# EAGLE design riffle328-REVB (EAGLE 6.5.0)
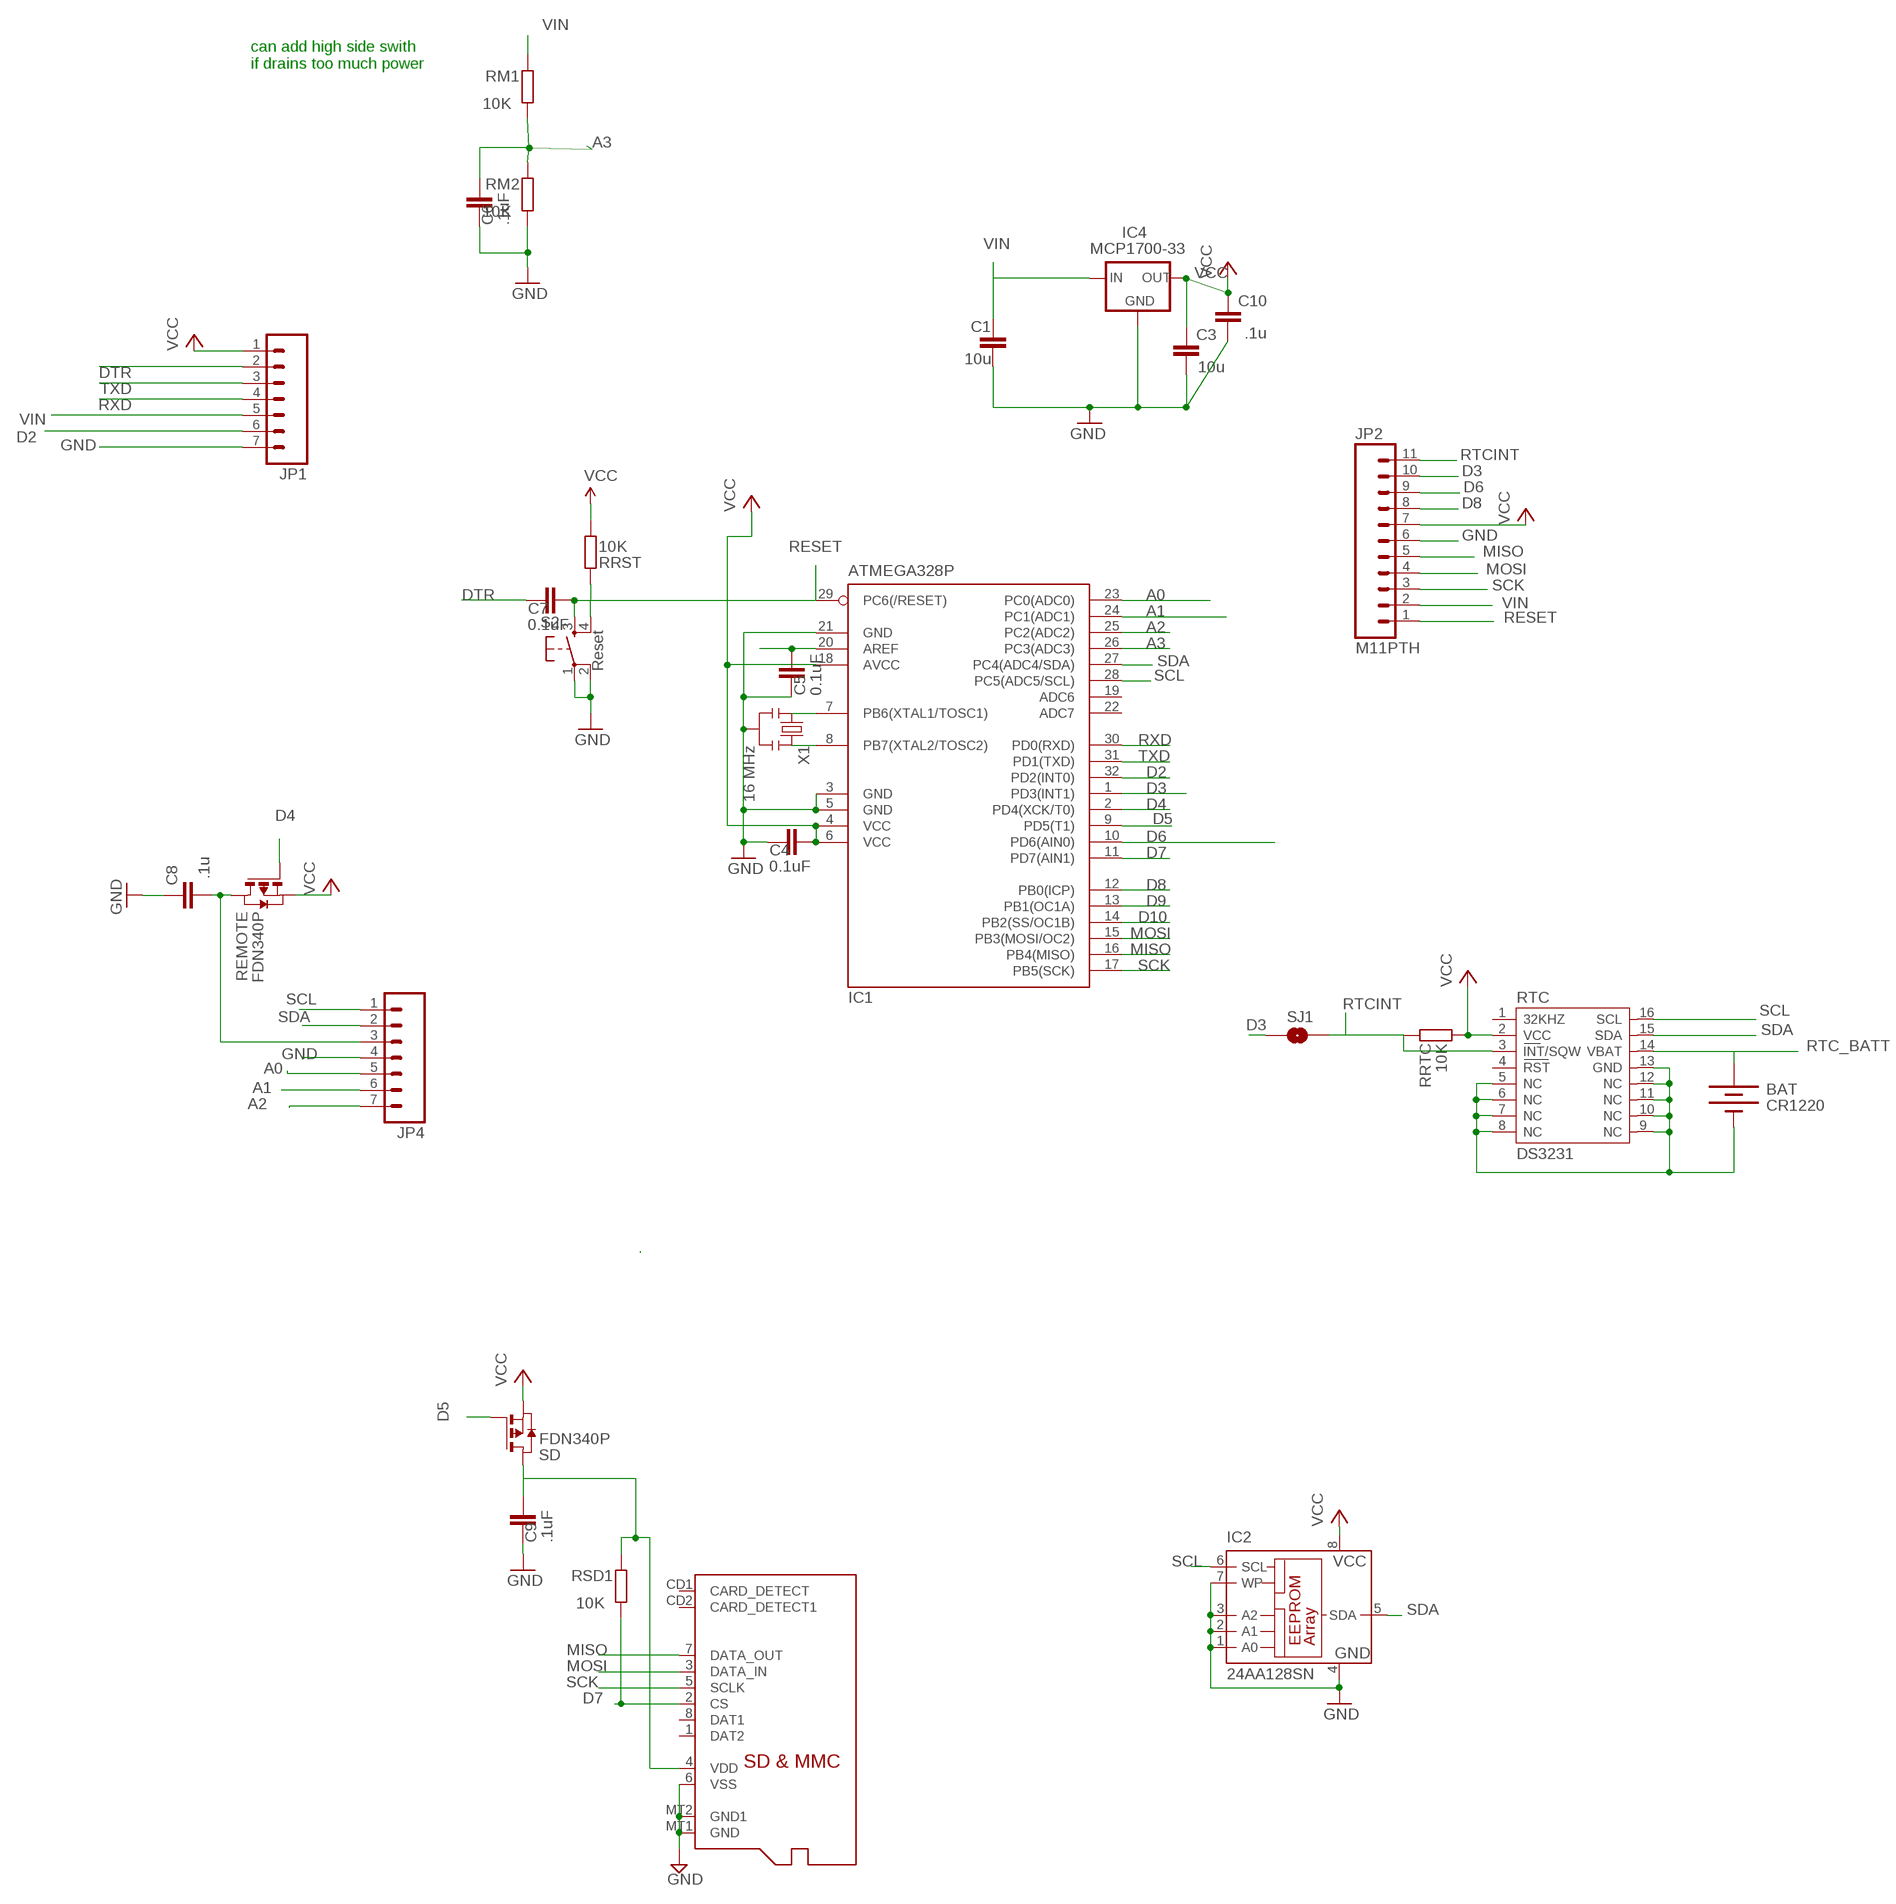
[diagram p0: schematic, sheet 1]

## Parts
BAT  CR1220  BATTERYBATTERY_12MM_SMT  [BATTCON_12MM_SMT]
C1  10u  C-EUC0805  [C0805]
C3  10u  C-EUC0805  [C0805]
C4  0.1uF  C-EUC0805  [C0805@1]
C5  0.1uF  C-EUC0805  [C0805@1]
C6  .1uF  C-EUC0805  [C0805@1]
C7  0.1uF  C-EUC0805  [C0805@1]
C8  .1u  C-EUC0805  [C0805]
C9  .1uF  C-EUC0805  [C0805@1]
C10  .1u  C-EUC0805  [C0805]
IC1  ATMEGA328P  MEGA8-AI  [TQFP32-08]
IC2  24AA128SN  [SO-08]
IC4  MCP1700-33  MCP1700SOT233  [SOT23]
JP1  M07  [1X07]
JP2  M11PTH  [1X11]
JP4  M07  [1X07]
MICROSD  MICROSD  [MICROSD]
REMOTE  FDN340P  PMOSSOT23  [SOT-23]
RM1  10K  R-EU_R0805  [R0805]
RM2  10K  R-EU_R0805  [R0805]
RRST  10K  R-EU_R0805  [R0805]
RRTC  10K  R-EU_R0805  [R0805]
RSD1  10K  R-EU_R0805  [R0805]
RTC  DS3231  [DS3231]
S2  Reset  TAC_SWITCHSMD  [TACTILE_SWITCH_SMD]
SD  FDN340P  PMOSSOT23  [SOT-23]
SJ1  SOLDERJUMPERNO  [SJ_2S-NO]
X1  16 MHz  RESONATORSMD  [RESONATOR-SMD]

## Nets
A0: IC1.23(PC0(ADC0)) JP4.5
A1: IC1.24(PC1(ADC1)) JP4.6
A2: IC1.25(PC2(ADC2)) JP4.7
A3: C6.2 IC1.26(PC3(ADC3)) RM1.1 RM2.2
AREF: C5.2 IC1.20(AREF)
D2: IC1.32(PD2(INT0)) JP1.6
D3: IC1.1(PD3(INT1)) JP2.10 SJ1.2
D4: IC1.2(PD4(XCK/T0)) REMOTE.3(G)
D5: IC1.9(PD5(T1)) SD.3(G)
D6: IC1.10(PD6(AIN0)) JP2.9
D7: IC1.11(PD7(AIN1)) MICROSD.2(CS) RSD1.1
D8: IC1.12(PB0(ICP)) JP2.8
D9: IC1.13(PB1(OC1A))
D10: IC1.14(PB2(SS/OC1B))
DTR: C7.1 JP1.2
GND: BAT.P$1(-) C1.2 C3.2 C4.1 C5.1 C6.1 C8.1 C9.1 C10.2 IC1.3(GND) IC1.5(GND) IC1.21(GND) IC2.1(A0) IC2.2(A1) IC2.3(A2) IC2.4(GND) IC2.7(WP) IC4.1(GND) JP1.7 JP2.6 JP4.4 MICROSD.6(VSS) MICROSD.MT1(GND) MICROSD.MT2(GND1) RM2.1 RTC.5(NC) RTC.6(NC) RTC.7(NC) RTC.8(NC) RTC.9(NC) RTC.10(NC) RTC.11(NC) RTC.12(NC) RTC.13(GND) S2.1 S2.2 X1.2
MISO: IC1.16(PB4(MISO)) JP2.5 MICROSD.7(DATA_OUT)
MOSI: IC1.15(PB3(MOSI/OC2)) JP2.4 MICROSD.3(DATA_IN)
N$2: IC1.8(PB7(XTAL2/TOSC2)) X1.3
N$3: IC1.7(PB6(XTAL1/TOSC1)) X1.1
RESET: C7.2 IC1.29(PC6(/RESET)) JP2.1 RRST.2 S2.3 S2.4
RTC_BATT: BAT.P$2(+) RTC.14(VBAT)
RTCINT: JP2.11 RRTC.2 RTC.3(INT/SQW) SJ1.1
RXD: IC1.30(PD0(RXD)) JP1.4
SCK: IC1.17(PB5(SCK)) JP2.3 MICROSD.5(SCLK)
SCL: IC1.28(PC5(ADC5/SCL)) IC2.6(SCL) JP4.1 RTC.16(SCL)
SDA: IC1.27(PC4(ADC4/SDA)) IC2.5(SDA) JP4.2 RTC.15(SDA)
TXD: IC1.31(PD1(TXD)) JP1.3
VCC: C3.1 C4.2 C8.2 C10.1 IC1.4(VCC) IC1.6(VCC) IC1.18(AVCC) IC2.8(VCC) IC4.2(OUT) JP1.1 JP2.7 JP4.3 REMOTE.1(D) REMOTE.2(S) RRST.1 RRTC.1 RTC.2(VCC) SD.2(S)
VDD: C9.2 MICROSD.4(VDD) RSD1.2 SD.1(D)
VIN [power]: C1.1 IC4.3(IN) JP1.5 JP2.2 RM1.2
Unconnected: IC1.19(ADC6) IC1.22(ADC7) MICROSD.1(DAT2) MICROSD.8(DAT1) MICROSD.CD1(CARD_DETECT) MICROSD.CD2(CARD_DETECT1) RTC.1(32KHZ) RTC.4(RST)

## Notes on the sheet
- can add high side swith
  if drains too much power

## Library data of the parts
BAT = SparkFunNew:BATTERY: Battery Holders Various common sizes : AA, AAA, 20mm coin cell and 12mm coin cell.
C1 C3 C8 C10 = resistor:C-EU: CAPACITOR, European symbol
C4-C7 C9 = rcl:C-EU: CAPACITOR, European symbol
IC1 = atmel:MEGA8: MICROCONTROLLER 8 Kbytes FLASH, 1 kbytes SRAM, 512 bytes EEPROM, USART, 6-channel 10 bit ADC, 2-channel 8 bit ADC Pin compatible with Atmega48, ATMega88, ATMega168 Source: avr.lbr; MPN: ATMEGA8-16AU; OC_FARNELL: 9171371; OC_NEWARK: 73M8863
IC2 = microchip:24*: Serial EEPROM I2C; MF: MICROCHIP; MPN: 24AA128-I/SN; OC_FARNELL: unknown; OC_NEWARK: 92C6842
IC4 = adafruit:MCP1700: VOLTAGE REGULATOR
JP1 JP4 = SparkFun-Connectors:M07: Header 7 Standard 7-pin 0.1" header. Use with straight break away headers (SKU : PRT-00116), right angle break away headers (PRT-00553), swiss pins (PRT-00743), machine pins (PRT-00117), and female headers (PRT-00115). NOTES ON THE VARIANTS LOCK and LOCK_LONGPADS... This footprint was designed to help hold the alignment of a through-hole component (i.e. 7-pin header) while soldering it into place. You may notice that each hole has been shifted either up or down by 0.005 of an inch from it's more standard position (which is usually a perfectly straight line). This slight alteration caused the pins (the squares in the middle) to touch the edges of the holes. Because they are alternating, it causes a "brace" to hold the header in place. 0.005 has proven to be the perfect amount of "off-center" position when using our standard breakaway headers. Although looks a little odd when you look at the bare footprint, once you have a header in there, the alteration is very hard to notice. Also, if you push a header all the way into place, it is covered up entirely on the bottom side. This idea of altering the position of holes to aid alignment will be further integrated into the Sparkfun Library for other footprints. It can help hold any component with 3 or more connection pins.
JP2 = SparkFun-Connectors:M11: Header 11 Standard 11-pin 0.1" header. Use with straight break away headers (SKU : PRT-00116), right angle break away headers (PRT-00553), swiss pins (PRT-00743), machine pins (PRT-00117), and female headers (PRT-00115).
MICROSD = adafruit:MICROSD: Micro-SD / Transflash card holder with SPI pinout For the 3M # 2908-05WB-MG and/or 4UCON #19656 push-push type
REMOTE SD = zetex:PMOSSOT23: MOS FET
RM1 RM2 RRST RRTC RSD1 = rcl:R-EU_: RESISTOR, European symbol
RTC = _lh-library:DS3231
S2 = SparkFun:TAC_SWITCH: Momentary Switch Button commonly used for reset or general input. Spark Fun Electronics SKU : COM-00097
SJ1 = _SparkFun:SOLDERJUMPER: Solder Jumper Standard SMD solder jumper. Used to automate production. Two varients : Normally Open and Normally Closed are the same, but have different paste layers. NC will have a large amount of paste and should jumper during reflow.
X1 = SparkFun:RESONATOR: Resonator Small SMD resonator. This is the itty bitty 10/20MHz resonators with built in caps. CSTCE10M0G55 and CSTCE20M0V53. Footprint has been reviewed closely but hasn't been tested yet.

## Net classes
0 default: width 0.203 mm, clearance 0.203 mm
1 power: width 0.381 mm, clearance 0.254 mm

## Board
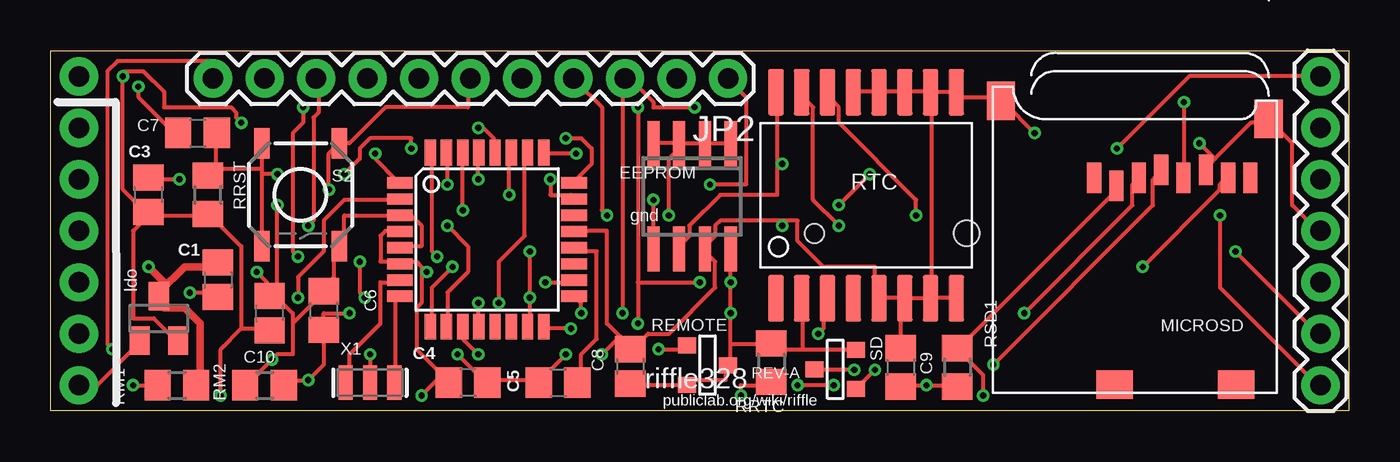
[diagram p1: board, top side]
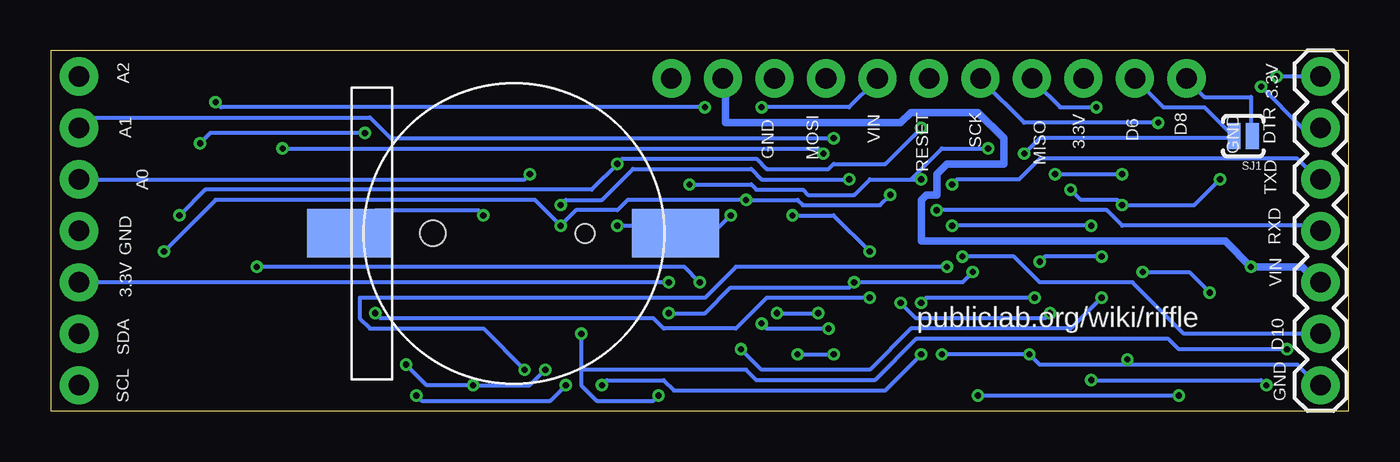
[diagram p2: board, bottom side, seen from below]

Size 64.01 x 17.78 mm. Coordinates in mm from the lower left corner, seen from the top.
Outline: 0,0 0,17.78 64.01,17.78 64.01,0 0,0
Copper layers (1*2*15*16): Top 0.035mm / dielectric 0.2mm / layer 2 0.0175mm / dielectric 1.1mm / layer 15 0.0175mm / dielectric 0.2mm / Bottom 0.035mm
Design rules "SeeedStudio_DRU_no_angle_20130527": minimum track width 6mil, minimum drill 12mil, track to track 6mil, track to pad 6mil, pad to pad 6mil, via to via 6mil, smd to smd 0mil, copper to edge 10mil, drill to drill 10mil, minimum pad ring 6mil, minimum via ring 6mil, stop-mask expansion 2mil, vias tented up to drill 25mil, thermal gap 10mil

### Footprints (pad centres in the part's own frame; a part is rotated, then mirrored left to right if it is on the bottom)
BATTCON_12MM_SMT = smd 2.4 x 4.3: P$1 0,11.96 | smd 2.4 x 4.2: P$2 0,-4.1 | hole 0.95: 0,7.5 | hole 1.25: 0,0
C0805 = smd 1.3 x 1.5: 1 -0.85,0; 2 0.85,0
C0805@1 = smd 1.3 x 1.5: 1 -0.95,0; 2 0.95,0
TQFP32-08 = smd 1.27 x 0.559: 1 -4.293,2.8; 2 -4.293,2; 3 -4.293,1.2; 4 -4.293,0.4; 5 -4.293,-0.4; 6 -4.293,-1.2; 7 -4.293,-2; 8 -4.293,-2.8; 17 4.293,-2.8; 18 4.293,-2; 19 4.293,-1.2; 20 4.293,-0.4; 21 4.293,0.4; 22 4.293,1.2; 23 4.293,2; 24 4.293,2.8 | smd 0.559 x 1.27: 9 -2.8,-4.293; 10 -2,-4.293; 11 -1.2,-4.293; 12 -0.4,-4.293; 13 0.4,-4.293; 14 1.2,-4.293; 15 2,-4.293; 16 2.8,-4.293; 25 2.8,4.293; 26 2,4.293; 27 1.2,4.293; 28 0.4,4.293; 29 -0.4,4.293; 30 -1.2,4.293; 31 -2,4.293; 32 -2.8,4.293
SO-08 = smd 0.6 x 2.2: 1 -1.905,-2.6; 2 -0.635,-2.6; 3 0.635,-2.6; 4 1.905,-2.6; 5 1.905,2.6; 6 0.635,2.6; 7 -0.635,2.6; 8 -1.905,2.6
SOT23 = smd 1 x 1.4: 1 -0.95,-1.1; 2 0.95,-1.1; 3 0,1.1
1X07 = drill 1.016 pad 1.88: 1 0,0; 2 2.54,0; 3 5.08,0; 4 7.62,0; 5 10.16,0; 6 12.7,0; 7 15.24,0
1X11 = drill 1.016 pad 1.88: 1 0,0; 2 2.54,0; 3 5.08,0; 4 7.62,0; 5 10.16,0; 6 12.7,0; 7 15.24,0; 8 17.78,0; 9 20.32,0; 10 22.86,0; 11 25.4,0
MICROSD = smd 0.7 x 1.5: 1 9,-10.64; 2 7.9,-10.24; 3 6.8,-10.64; 4 5.7,-11.04; 5 4.6,-10.64; 6 3.5,-11.04; 7 2.4,-10.64; 8 1.3,-10.64 | smd 1.8 x 1.4: CD1 2,-0.44; CD2 8,-0.44 | smd 1.4 x 1.9: MT1 0.4,-13.54; MT2 13.6,-14.44
SOT-23 = smd 0.787 x 0.889: 1 0.025,-1.016; 2 -0.94,1.016; 3 0.991,1.016
R0805 = smd 1.3 x 1.5: 1 -0.95,0; 2 0.95,0
DS3231 = smd 0.762 x 2.286: 1 -4.445,-5.08; 2 -3.175,-5.08; 3 -1.905,-5.08; 4 -0.635,-5.08; 5 0.635,-5.08; 6 1.905,-5.08; 7 3.175,-5.08; 8 4.445,-5.08; 9 4.445,5.08; 10 3.175,5.08; 11 1.905,5.08; 12 0.635,5.08; 13 -0.635,5.08; 14 -1.905,5.08; 15 -3.175,5.08; 16 -4.445,5.08
TACTILE_SWITCH_SMD = smd 1.524 x 0.762: 1 -2.54,1.905; 2 2.54,1.905; 3 -2.54,-1.905; 4 2.54,-1.905
SJ_2S-NO = smd 0.635 x 1.27: 1 -0.45,0; 2 0.45,0
RESONATOR-SMD = smd 0.7 x 1.7: 1 -1.2,0; 2 0,0; 3 1.2,0

### Placement (x,y rotation side)
BAT  45.16,8.76 270 bottom
C1  8.25,6.48 270 top
C3  4.83,10.67 90 top
C4  20.57,1.4 180 top
C5  25.02,1.4 0 top
C6  13.46,4.95 270 top
C7  7.24,13.72 0 top
C8  28.58,2.21 270 top
C9  41.91,2.16 270 top
C10  10.79,4.83 90 top
IC1  21.51,8.46 0 top
IC2  31.62,10.59 180 top
IC4  5.33,4.57 0 top
JP1  1.4,16.51 270 bottom
JP2  33.4,16.41 180 top
JP4  62.61,1.27 90 top
MICROSD  60.45,0.86 180 top
REMOTE  32.38,2.24 90 top
RM1  6.22,1.27 0 top
RM2  10.54,1.27 0 top
RRST  7.75,10.67 90 top
RRTC  35.53,2.39 270 top
RSD1  44.7,2.16 270 top
RTC  40.21,10.64 0 top
S2  12.32,10.67 270 top
SD  38.68,2.08 270 top
SJ1  5.21,13.56 180 bottom
X1  15.75,1.4 0 top

### Tracks (layer width: path | path; a pad name or v marks a point on that pad's centre or on a via)
A0  (via drill 0.3)
  Top 0.203: v24.64,11.43 24.64,10.67 25.65,10.67 IC1.23 | v40.39,11.68 v38.86,10.16
  Bottom 0.203: v24.64,11.43 28.96,11.43 29.46,11.94 35.31,11.94 36.83,10.41 38.61,10.41 v38.86,10.16 | v40.39,11.68 40.64,11.43 JP4.5
A1  (via drill 0.3)
  Top 0.203: v25.4,13.46 26.16,13.46 26.67,12.95 26.67,12.19 25.91,11.43 IC1.24
  Bottom 0.203: v25.4,13.46 47.24,13.46 48.26,14.48 61.98,14.48 62.48,13.97 JP4.6
A2  (via drill 0.3)
  Top 0.203: v25.91,12.7 24.38,12.7 IC1.25 | v52.58,12.95 56.13,16.51 JP4.7
  Bottom 0.203: v25.91,12.7 26.16,12.95 v52.58,12.95
A3  (via drill 0.3)
  Top 0.203: v4.06,1.27 RM1.1 | RM2.2 11.68,1.27 11.68,1.52 v12.7,1.52 13.46,2.29 C6.2 13.46,4.83 v14.73,4.83 | v22.1,5.33 22.1,7.37 23.37,8.64 23.37,12.7 IC1.26
  Bottom 0.203: v4.06,1.27 4.32,1.52 v12.7,1.52 | v22.1,5.33 21.34,4.57 14.99,4.57 v14.73,4.83
AREF
  Top 0.203: IC1.20 25.91,7.87 26.92,7.87 26.92,3.56 26.16,2.79 26.16,1.52 C5.2
D2  (via drill 0.3)
  Top 0.203: v19.05,7.62 18.8,7.87 18.8,12.7 IC1.32
  Bottom 0.203: v19.05,7.62 16.51,7.62 15.24,6.35 10.67,6.35 8.13,3.81 JP1.6
D3  (via drill 0.3)
  Top 0.203: v16,12.7 16,12.45 17.02,11.43 IC1.1
  Bottom 0.203: JP2.10 10.41,16.26 9.14,14.99 7.11,14.99 5.84,13.72 SJ1.2 5.84,13.46 15.24,13.46 v16,12.7
D4  (via drill 0.3)
  Top 0.203: v29.97,3.05 31.24,3.05 REMOTE.3 | v12.19,5.59 12.19,6.6 13.46,7.87 13.46,9.4 14.48,10.41 17.02,10.41 IC1.2
  Bottom 0.203: v29.97,3.05 28.96,2.03 23.62,2.03 21.59,4.06 13.72,4.06 v12.19,5.59
D5  (via drill 0.3)
  Top 0.203: v40.64,2.03 SD.3 | v19.81,7.11 18.8,6.1 18.8,4.32 IC1.9
  Bottom 0.203: v40.64,2.03 42.67,4.06 48.26,4.06 48.77,4.57 48.77,5.59 31.75,5.59 30.23,7.11 v19.81,7.11
D6  (via drill 0.3)
  Top 0.203: v19.56,9.14 20.57,8.13 20.57,6.86 19.56,5.84 19.56,4.32 IC1.10 | v12.7,9.14 12.95,9.4 12.95,14.48 13.21,14.73 13.21,16.26 JP2.9
  Bottom 0.203: v12.7,9.14 v19.56,9.14
D7  (via drill 0.3)
  Top 0.203: v21.08,2.79 20.32,3.56 20.32,4.06 IC1.11 | v38.61,1.27 v36.83,1.27 | v45.97,0.76 45.97,1.78 44.7,3.05 | 44.7,3.05 52.32,10.67 52.32,10.92 MICROSD.2 | 44.7,3.05 RSD1.1
  Bottom 0.203: v21.08,2.79 22.86,1.02 33.27,1.02 33.78,1.52 36.58,1.52 v36.83,1.27 | v38.61,1.27 39.37,0.51 45.72,0.51 v45.97,0.76
D8  (via drill 0.3)
  Top 0.203: v21.08,5.33 21.08,4.32 IC1.12 | v15.49,5.59 15.24,5.84 v15.24,7.37 | v12.19,7.62 11.94,7.87 11.94,13.72 12.45,14.22 v12.45,14.99
  Bottom 0.203: v21.08,5.33 20.83,5.59 v15.49,5.59 | v15.24,7.37 14.99,7.62 v12.19,7.62 | v12.45,14.99 14.22,14.99 15.49,16.26 JP2.8
DTR  (via drill 0.3)
  Top 0.203: v4.32,16 4.32,15.49 6.1,13.72 C7.1
  Bottom 0.203: v4.32,16 2.29,13.97 JP1.2
GND  (via drill 0.3)
  Top 0.203: JP1.7 2.29,1.27 4.32,3.3 IC4.1 | v15.75,2.79 X1.2 | v20.07,2.79 21.34,1.52 C4.1 21.59,1.52 23.88,1.52 C5.1 24.13,1.52 v25.4,2.79 | JP2.6 20.57,16.26 20.57,14.99 16.51,14.99 14.73,13.21 S2.1 13.72,12.7 v13.72,10.92 | IC1.5 17.27,8.13 18.29,8.13 18.29,9.14 17.78,9.65 17.27,9.65 IC1.3 17.02,9.65 14.48,9.65 14.48,8.38 S2.2 13.97,7.87 13.97,6.6 13.46,6.1 C6.1 13.46,5.84 11.94,4.32 | 11.94,4.32 11.94,4.83 11.18,5.59 | 11.94,4.32 11.94,2.79 11.18,2.79 v10.92,2.54 9.65,1.27 RM2.1 | 11.18,5.59 10.92,5.84 C10.2 | v6.86,5.84 8.13,5.84 C1.2 | v10.16,6.86 10.67,6.35 10.67,5.84 C10.2 | v6.35,11.43 4.83,11.43 C3.2 | 11.18,5.59 v11.18,10.16 | 11.18,5.59 C10.2 | 57.4,12.45 59.18,14.22 59.94,14.22 MICROSD.MT1 60.2,14.22 61.21,13.21 61.21,10.16 62.48,8.89 JP4.4 | 57.4,12.45 57.15,12.19 57.15,11.94 MICROSD.6 | 30.99,13.21 29.72,13.21 IC2.4 | 30.99,13.21 32.26,13.21 | 30.99,13.21 IC2.3 30.99,12.95 30.48,12.45 v30.48,9.65 | 32.26,13.21 33.53,13.21 IC2.1 | 32.26,13.21 IC2.2 | 27.94,3.81 28.45,3.3 C8.1 28.7,3.05 29.46,3.81 30.48,3.81 32.77,6.1 32.77,7.37 32.26,7.87 IC2.7 32.26,8.13 32.77,8.64 32.77,9.14 33.02,9.4 36.07,9.4 | 27.94,3.81 27.43,4.32 27.43,8.89 25.91,8.89 IC1.21 | 43.43,5.59 44.45,5.59 RTC.8 | C9.1 41.91,5.33 RTC.6 | RTC.6 41.91,5.59 40.89,5.59 RTC.5 40.64,5.59 40.64,7.11 38.1,7.11 36.83,8.38 36.83,9.4 36.07,9.4 | RTC.6 42.16,5.59 43.18,5.59 RTC.7 43.43,5.59 | RTC.13 39.62,15.75 40.64,15.75 RTC.12 40.89,15.75 41.91,15.75 RTC.11 42.16,15.75 43.18,15.75 RTC.10 | RTC.10 43.43,15.75 44.45,15.75 RTC.9 44.7,15.49 46.74,15.49 MICROSD.MT2 46.99,15.24 v48.51,13.72 | 43.43,5.59 43.43,15.49 RTC.10
  Top 0.203: 36.07,9.4 v36.07,9.14 | v56.64,13.21 57.4,12.45 | v27.18,2.79 27.94,3.56 27.94,3.81
  Bottom 0.203: 10.92,2.29 2.54,2.29 1.52,1.27 JP1.7 | 10.92,2.29 15.24,2.29 v15.75,2.79 v20.07,2.79 | v6.86,5.84 7.87,6.86 v10.16,6.86 | v6.35,11.43 7.62,10.16 v11.18,10.16 11.43,10.41 13.21,10.41 v13.72,10.92 | v10.92,2.54 10.92,2.29 | v30.48,9.65 31.24,8.89 33.02,8.89 BAT.P$1 33.27,8.89 33.53,9.14 v36.07,9.14 | v56.64,13.21 56.13,13.72 v48.51,13.72 | v27.18,2.79 v25.4,2.79
MISO  (via drill 0.3)
  Top 0.203: v25.65,4.06 24.38,4.06 IC1.16 | v28.96,14.99 28.96,6.35 | 28.96,6.35 v28.96,4.32 | v53.85,7.11 57.66,10.92 57.66,11.18 57.91,11.43 MICROSD.7 | 28.96,6.35 v32,6.35
  Bottom 0.203: v25.65,4.06 28.7,4.06 v28.96,4.32 | v28.96,14.99 24.64,14.99 23.37,16.26 JP2.5 | v53.85,7.11 32.77,7.11 v32,6.35
MOSI  (via drill 0.3)
  Top 0.203: v23.62,7.87 v23.62,5.59 23.62,4.32 IC1.15 | v27.43,9.65 27.18,9.91 27.18,14.99 25.91,16.26 JP2.4 | v48.01,4.83 53.34,10.16 53.34,11.18 53.59,11.43 MICROSD.3
  Bottom 0.203: v23.62,7.87 25.4,9.65 v27.43,9.65 | v48.01,4.83 47.75,4.57 34.29,4.57 33.78,4.06 30.23,4.06 28.7,5.59 v23.62,5.59
N$2
  Top 0.203: IC1.8 17.02,5.59 17.02,1.52 X1.3
N$3
  Top 0.203: IC1.7 17.02,6.35 16.26,6.35 16.26,4.32 14.73,2.79 14.73,1.52 X1.1
RESET  (via drill 0.3)
  Top 0.203: 8.13,11.94 7.87,11.68 RRST.2 8.13,11.94 | 8.13,11.94 8.13,13.72 C7.2 | S2.3 10.41,11.94 | 10.41,11.94 10.41,11.68 | 10.41,11.68 S2.4 | 10.41,11.94 8.13,11.94 | v21.08,11.43 21.08,12.7 IC1.29 | v32.51,11.18 34.29,11.18 34.29,15.49 33.53,16.26 JP2.1 | v11.18,11.68 10.41,11.68 | v14.48,11.68 15.24,12.45 15.24,12.95 15.75,13.46 17.78,13.46 v17.78,12.95
  Bottom 0.203: 21.59,11.43 23.62,11.43 24.38,10.67 26.67,10.67 26.92,10.92 29.21,10.92 29.46,11.18 v32.51,11.18 | 21.59,11.43 v21.08,11.43 | v14.48,11.68 v11.18,11.68 | v17.78,12.95 20.07,12.95 21.59,11.43
RTC_BATT  (via drill 0.3)
  Top 0.203: v42.67,9.65 42.67,10.41 38.86,14.22 38.86,14.99 38.35,15.49 RTC.14
  Bottom 0.203: v42.67,9.65 42.93,9.91 48.01,9.91 49.02,8.89 BAT.P$2
RTCINT  (via drill 0.3)
  Top 0.203: v34.04,0.76 34.04,1.27 35.31,1.27 RRTC.2 | v37.85,3.81 38.1,4.06 38.1,5.33 RTC.3 | v3.05,3.05 2.79,3.3 2.79,16.76 3.3,17.27 7.87,17.27 7.87,16.51 JP2.11
  Bottom 0.203: v34.04,0.76 34.29,0.51 37.08,0.51 37.85,1.27 37.85,2.03 | v37.85,3.81 37.85,2.03 | SJ1.1 4.83,13.72 4.83,15.49 7.11,15.49 7.87,16.26 JP2.11 | 37.85,2.03 29.72,2.03 29.21,1.52 23.37,1.52 21.34,3.56 8.89,3.56 8.38,3.05 v3.05,3.05
RXD  (via drill 0.3)
  Top 0.203: v20.32,9.91 20.32,12.7 IC1.30
  Bottom 0.203: v20.32,9.91 11.94,9.91 11.18,9.14 1.78,9.14 1.52,8.89 JP1.4
SCK  (via drill 0.3)
  Top 0.203: v26.16,4.83 26.16,5.33 25.91,5.59 IC1.17 | v28.19,4.83 28.19,16.26 JP2.3 28.45,16.51 29.72,15.24 29.72,14.99 v31.75,14.99 | v55.88,15.24 55.88,11.68 MICROSD.5
  Bottom 0.203: v28.19,4.83 v26.16,4.83 | v55.88,15.24 55.63,14.99 v31.75,14.99
SCL  (via drill 0.3)
  Top 0.203: v21.08,13.97 21.34,13.97 21.84,13.46 21.84,12.95 IC1.28 | 35.81,12.45 v36.07,12.19 | 35.81,12.45 35.81,15.49 RTC.16 | 35.81,12.45 35.81,10.67 33.02,10.67 31.5,9.14 31.5,8.64 30.99,8.13 IC2.6 | v57.66,9.65 57.66,6.1 62.48,1.27 JP4.1
  Bottom 0.203: v21.08,13.97 22.86,12.19 25.4,12.19 25.65,11.94 28.7,11.94 29.21,12.45 35.81,12.45 v36.07,12.19 37.34,10.92 56.39,10.92 v57.66,9.65
SDA  (via drill 0.3)
  Top 0.203: v22.61,10.67 22.61,12.7 IC1.27 | IC2.5 v29.72,10.41 | v38.86,9.14 37.59,10.41 37.59,14.99 37.08,15.49 RTC.15 | v58.42,7.87 62.48,3.81 JP4.2
  Bottom 0.203: v22.61,10.67 23.11,10.16 26.92,10.16 27.18,10.41 v29.72,10.41 35.56,10.41 36.07,9.91 38.1,9.91 v38.86,9.14 40.13,10.41 55.88,10.41 v58.42,7.87
TXD  (via drill 0.3)
  Top 0.203: v19.56,11.18 19.56,12.7 IC1.31
  Bottom 0.203: v19.56,11.18 19.3,11.43 16.26,11.43 15.24,12.45 2.54,12.45 1.52,11.43 JP1.3
VCC  (via drill 0.3)
  Top 0.203: 4.83,9.65 4.06,8.89 4.06,4.57 5.08,4.57 6.1,3.56 IC4.2 | 4.83,9.65 7.62,9.65 RRST.1 7.87,9.65 9.4,8.13 9.4,4.06 | 9.4,4.06 10.67,4.06 C10.1 | v9.4,14.22 9.14,14.48 9.14,14.73 8.89,14.99 5.59,14.99 5.59,15.75 4.57,16.76 3.56,16.76 v3.56,16.51 3.56,10.92 4.83,9.65 | 4.83,9.65 C3.1 | IC1.4 17.02,8.89 16.51,8.89 16.26,8.64 16.26,7.37 17.02,7.37 IC1.6 17.27,7.37 18.03,7.37 18.29,7.11 | v24.38,6.35 25.65,6.35 IC1.18 | 18.29,7.11 v18.54,6.86 | 19.3,1.78 18.03,3.05 18.03,5.08 18.29,5.33 18.29,7.11 | 19.3,1.78 19.56,1.52 C4.2 19.3,1.78 | 37.08,3.05 35.56,3.05 35.56,3.3 RRTC.1 35.31,3.3 33.53,3.3 | 37.08,3.05 39.62,3.05 SD.2 | 37.08,3.05 37.08,5.33 RTC.2 | 33.53,8.13 IC2.8 v33.53,6.35 v33.53,4.83 33.53,3.3 | C8.2 28.7,1.27 31.24,1.27 REMOTE.2 31.5,1.52 33.27,1.52 33.27,2.03 REMOTE.1 33.53,2.29 33.53,3.3 | 9.4,4.06 8.38,3.05 v8.38,0.76 | 19.3,1.78 v18.29,0.76
  Bottom 0.203: v9.4,14.22 16,14.22 18.03,16.26 JP2.7 | v3.56,16.51 JP1.1 | v18.54,6.86 19.05,6.35 v24.38,6.35 24.64,6.1 30.48,6.1 31.75,4.83 v33.53,4.83 | v33.53,6.35 JP4.3 | v18.29,0.76 v8.38,0.76
VDD  (via drill 0.3)
  Top 0.203: v39.62,2.03 37.85,2.03 SD.1 | C9.2 41.91,1.27 v43.18,1.27 44.7,1.27 RSD1.2 | v46.48,2.29 54.36,10.16 54.36,11.43 54.61,11.68 MICROSD.4
  Bottom 0.203: v39.62,2.03 40.39,1.27 v43.18,1.27 45.47,1.27 v46.48,2.29
VIN  (via drill 0.3)
  Top 0.381: IC4.3 5.33,5.84 6.6,7.11 8.13,7.11 C1.1 | RM1.2 7.37,1.27 7.37,4.32 6.6,5.08 5.59,5.08 5.59,5.84 IC4.3 | v4.83,7.11 5.59,6.35 IC4.3
  Bottom 0.381: JP1.5 1.52,6.35 2.29,7.11 v4.83,7.11 6.1,8.38 21.08,8.38 21.08,10.41 20.83,10.67 20.32,10.67 20.32,11.68 19.81,12.19 17.02,12.19 17.02,13.46 18.29,14.73 21.59,14.73 22.1,14.22 30.73,14.22 30.73,16.26 JP2.2

### Text on the board
tPlace: EEPROM | gnd | ldo | riffle328 | REV-A | publiclab.org/wiki/riffle
bPlace: A2 | 3.3V | GND | D8 | 3.3V | SCK | RESET | VIN | MOSI | A1 | D6 | MISO | GND | DTR | A0 | TXD | GND | RXD | 3.3V | VIN | publiclab.org/wiki/riffle | SDA | D10 | SCL | GND